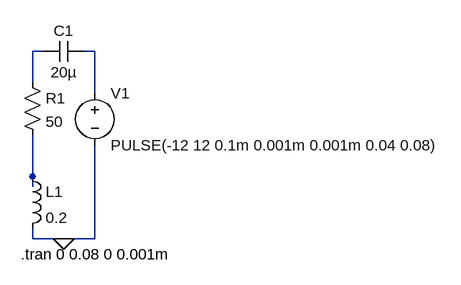
[diagram p0: schematic 4.asc]
4.asc, the LTspice schematic file:
Version 4
SHEET 1 880 680
WIRE -16 -208 -32 -208
WIRE 64 -208 48 -208
WIRE -32 -160 -32 -208
WIRE 64 -144 64 -208
WIRE -32 -16 -32 -80
WIRE -32 0 -32 -16
WIRE -32 80 -32 64
WIRE 16 80 -32 80
WIRE 64 80 64 -64
WIRE 64 80 16 80
FLAG 16 80 0
SYMBOL res -48 -176 R0
SYMATTR InstName R1
SYMATTR Value 50
SYMBOL voltage 64 -160 R0
WINDOW 123 0 0 Left 0
WINDOW 39 0 0 Left 0
SYMATTR InstName V1
SYMATTR Value PULSE(-12 12 0.1m 0.001m 0.001m 0.04 0.08)
SYMBOL ind -48 -32 R0
SYMATTR InstName L1
SYMATTR Value 0.2
SYMBOL cap 48 -224 R90
WINDOW 0 0 32 VBottom 2
WINDOW 3 32 32 VTop 2
SYMATTR InstName C1
SYMATTR Value 20µ
TEXT -50 104 Left 2 !.tran 0 0.08 0 0.001m

The netlist it stands for:
* 4.asc
R1 N001 N003 50
V1 N002 0 PULSE(-12 12 0.1m 0.001m 0.001m 0.04 0.08)
L1 N003 0 0.2
C1 N002 N001 20µ
.tran 0 0.08 0 0.001m
.backanno
.end